# EAGLE design CANMP3_rev6_ar (EAGLE 8.5.0)
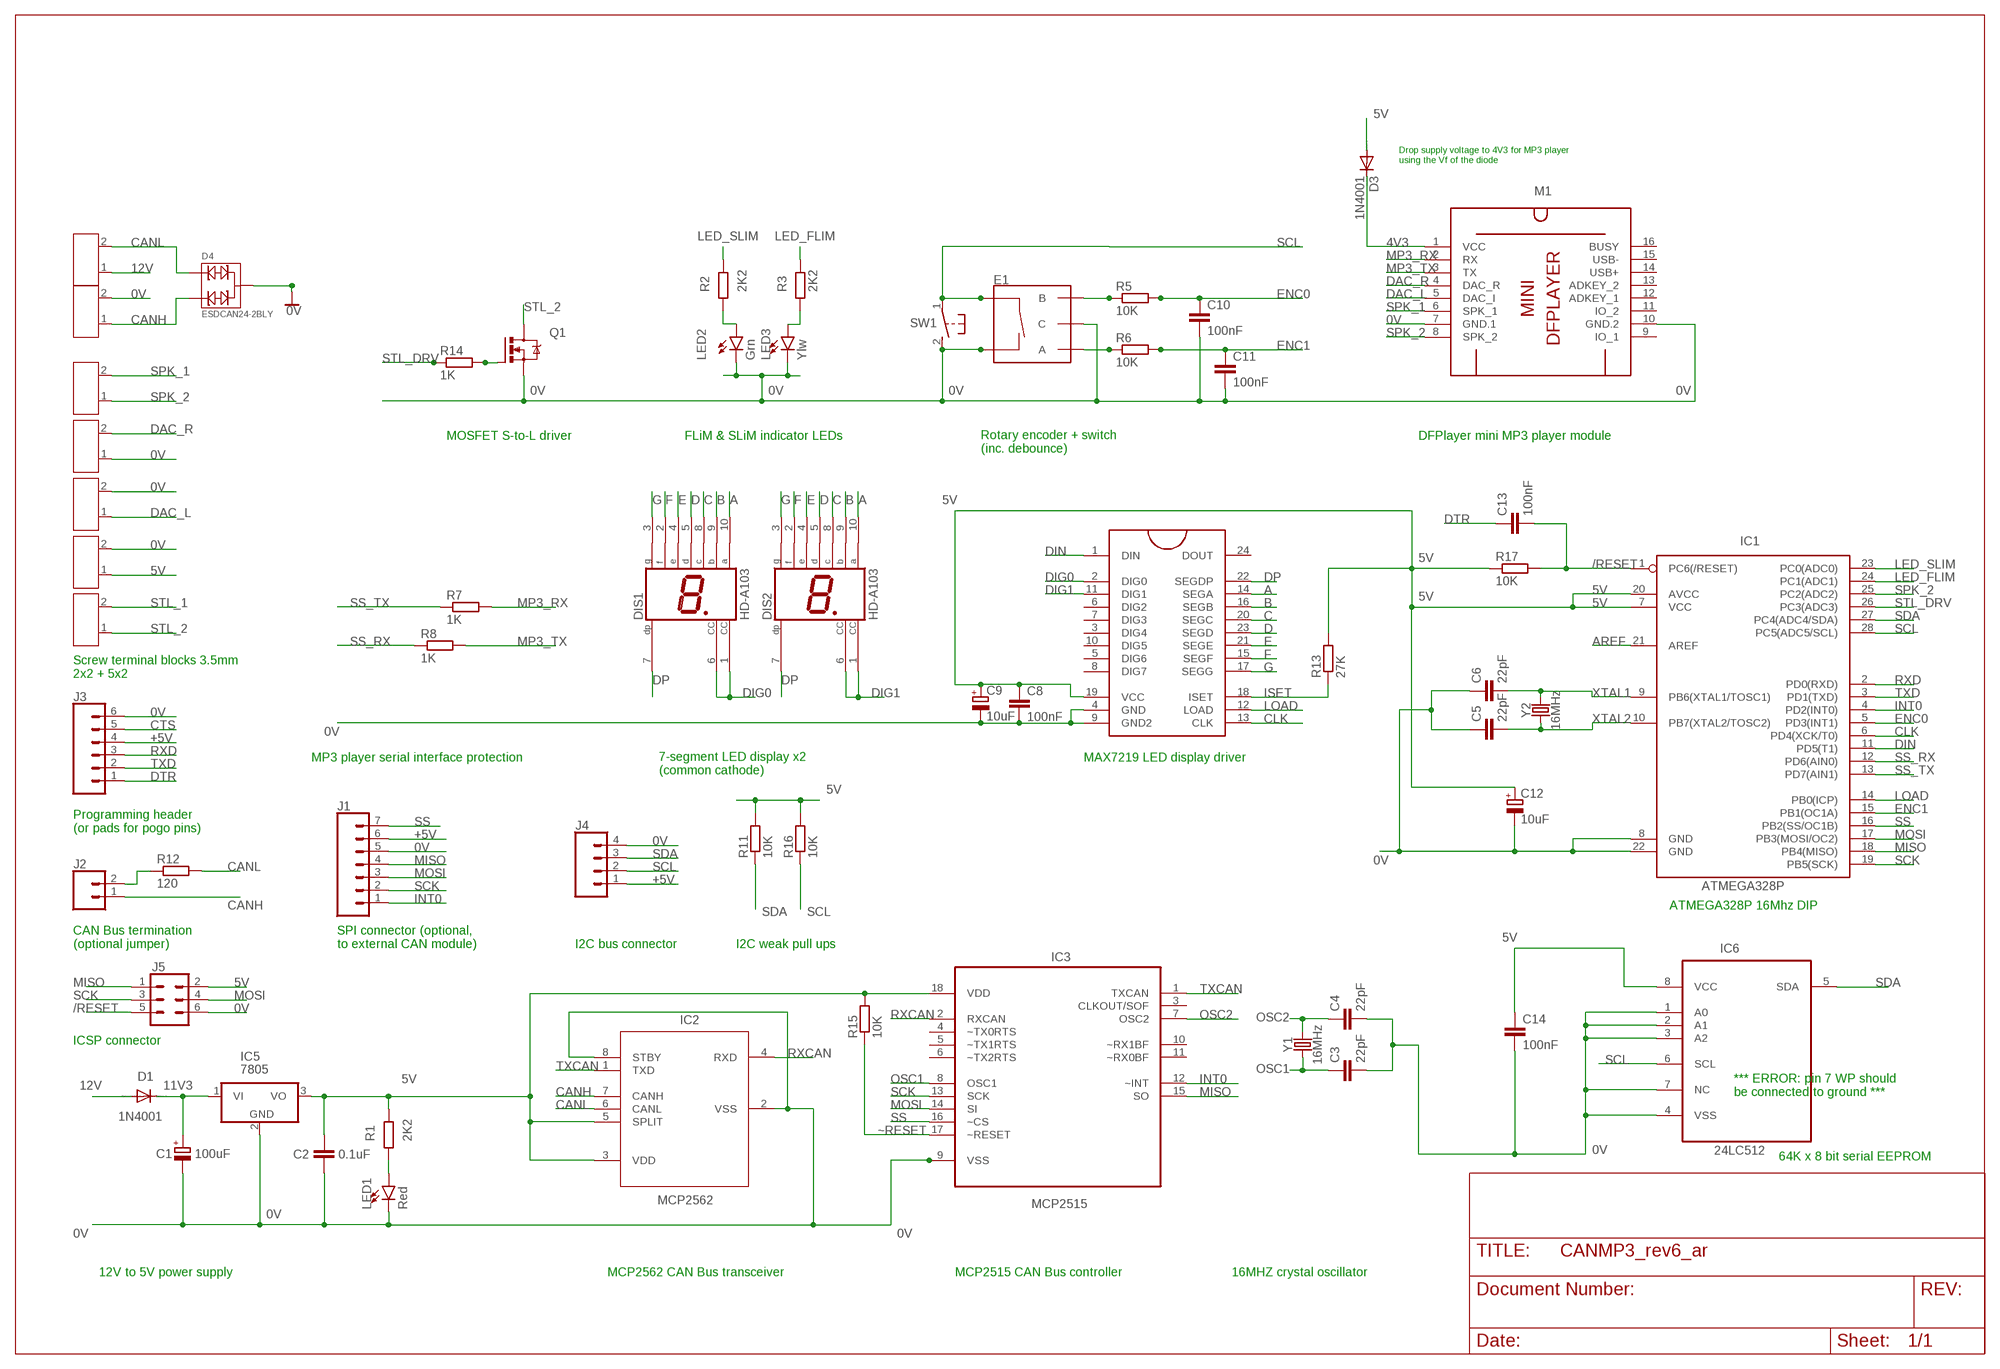
[diagram p0: schematic, sheet 1]

## Parts
C1  100uF  CPOL-EUE2.5-6  [E2,5-6]
C2  0.1uF  C-EU025-025X050  [C025-025X050]
C3  22pF  C-EU025-024X044  [C025-024X044]
C4  22pF  C-EU025-024X044  [C025-024X044]
C5  22pF  C-EU025-024X044  [C025-024X044]
C6  22pF  C-EU025-024X044  [C025-024X044]
C8  100nF  C-EU025-024X044  [C025-024X044]
C9  10uF  CPOL-EUE2.5-5  [E2,5-5]
C10  100nF  C-EU025-024X044  [C025-024X044]
C11  100nF  C-EU025-024X044  [C025-024X044]
C12  10uF  CPOL-EUE2,5-6E  [E2,5-6E]
C13  100nF  C-EU025-024X044  [C025-024X044]
C14  100nF  C-EU025-024X044  [C025-024X044]
D1  1N4001  DIODE-DO41-10  [DO41-10]
D3  1N4001  DIODE-DO41-10  [DO41-10]
D4  ESDCAN24-2BLY  SMD-DIODE-TVS-5V-225MW(SOT-23)  [SOT-23]
DIS1  HD-A103  [HDSP-A]
DIS2  HD-A103  [HDSP-A]
E1  ENCODER-SWITCH  [ROTARY_ENC_PLAIN]
IC1  ATMEGA328P  ATMEGA328P_PDIP  [DIP28]
IC2  MCP2562  MCP2562-E/P  [PDIP8_300MC]
IC3  MCP2515  MCP2515-I/P  [DIP254P762X432-18]
IC4  MAX7219  MAX7219DIP  [DIL24]
IC5  7805  7805TV  [TO220V]
IC6  24LC512  24C65/P  [DIP254P762X432-8]
J1  CONN_07  [1X07]
J2  CONN_02  [1X02]
J3  CONN_06SILK_FEMALE_PTH  [1X06]
J4  CONN_04  [1X04]
J5  FEMALE 2x3  CONN_03X2FEMALE  [2X3]
LED1  Red  LED3MM  [LED_3MM]
LED2  Grn  LED3MM  [LED_3MM]
LED3  Ylw  LED3MM  [LED_3MM]
M1  DFPLAYER-MINI-MODULE  [DFPLAYER-MINI-MODULE]
Q1  IRF540  [TO220BV]
R1  2K2  R-EU_0207/10  [0207/10]
R2  2K2  R-EU_0207/10  [0207/10]
R3  2K2  R-EU_0207/10  [0207/10]
R5  10K  R-EU_0207/10  [0207/10]
R6  10K  R-EU_0207/10  [0207/10]
R7  1K  R-EU_0207/10  [0207/10]
R8  1K  R-EU_0207/10  [0207/10]
R11  10K  R-EU_0207/10  [0207/10]
R12  120  R-EU_0207/10  [0207/10]
R13  27K  R-EU_0207/10  [0207/10]
R14  1K  R-EU_0207/10  [0207/10]
R15  10K  R-EU_0207/10  [0207/10]
R16  10K  R-EU_0207/10  [0207/10]
R17  10K  R-EU_0207/10  [0207/10]
SW1  DTS-3  [DTS-3]
TB1  SCREW-TERMINAL-GREEN(2P-3.5)  [H2-3.5-7.0X7.0MM]
TB2  SCREW-TERMINAL-GREEN(2P-3.5)  [H2-3.5-7.0X7.0MM]
TB3  SCREW-TERMINAL-GREEN(2P-3.5)  [H2-3.5-7.0X7.0MM]
TB4  SCREW-TERMINAL-GREEN(2P-3.5)  [H2-3.5-7.0X7.0MM]
TB5  SCREW-TERMINAL-GREEN(2P-3.5)  [H2-3.5-7.0X7.0MM]
TB6  SCREW-TERMINAL-GREEN(2P-3.5)  [H2-3.5-7.0X7.0MM]
TB7  SCREW-TERMINAL-GREEN(2P-3.5)  [H2-3.5-7.0X7.0MM]
Y1  16MHz  CRYSTAL-16MHZPTH-HC49US  [HC49US]
Y2  16MHz  CRYSTAL-16MHZPTH-HC49US  [HC49US]

## Nets
0V [power]: C1.- C2.2 C3.2 C4.2 C5.1 C6.1 C8.2 C9.- C10.2 C11.2 C12.- C14.2 D4.3 E1.C E1.SW- IC1.8(GND) IC1.22(GND) IC2.2(VSS) IC2.8(STBY) IC3.9(VSS) IC4.4(GND) IC4.9(GND2) IC5.2(GND) IC6.1(A0) IC6.2(A1) IC6.3(A2) IC6.4(VSS) IC6.7(NC) J1.5 J3.6 J4.4 J5.6 LED1.K(C) LED2.K(C) LED3.K(C) M1.7(GND.1) M1.10(GND.2) Q1.S SW1.2 TB2.2 TB4.2 TB5.2 TB6.1
4V3: D3.C M1.1(VCC)
5V [power]: C2.1 C8.1 C9.+ C12.+ C14.1 D3.A IC1.7(VCC) IC1.20(AVCC) IC2.3(VDD) IC2.5(SPLIT) IC3.18(VDD) IC4.19(VCC) IC5.3(VO) IC6.8(VCC) J5.2 R1.2 R11.2 R13.2 R15.2 R16.2 R17.1 TB5.1
11V3 [power]: C1.+ D1.C IC5.1(VI)
12V [power]: D1.A TB1.1
+5V: J1.6 J3.4 J4.1
/RESET: C13.2 IC1.1(PC6(/RESET)) J5.5 R17.2
A: DIS1.10(A) DIS2.10(A) IC4.14(SEGA)
AREF: IC1.21(AREF)
B: DIS1.9(B) DIS2.9(B) IC4.16(SEGB)
C: DIS1.8(C) DIS2.8(C) IC4.20(SEGC)
CANH: D4.2 IC2.7(CANH) J2.1 TB2.1
CANL: D4.1 IC2.6(CANL) R12.2 TB1.2
CLK: IC1.6(PD4(XCK/T0)) IC4.13(CLK)
CTS: J3.5
D: DIS1.5(D) DIS2.5(D) IC4.23(SEGD)
DAC_L: M1.5(DAC_I) TB4.1
DAC_R: M1.4(DAC_R) TB6.2
DIG0: DIS1.1(CC) DIS1.6(CC) IC4.2(DIG0)
DIG1: DIS2.1(CC) DIS2.6(CC) IC4.11(DIG1)
DIN: IC1.11(PD5(T1)) IC4.1(DIN)
DP: DIS1.7(DP) DIS2.7(DP) IC4.22(SEGDP)
DTR: C13.1 J3.1
E: DIS1.4(E) DIS2.4(E) IC4.21(SEGE)
ENC0: C10.1 IC1.5(PD3(INT1)) R5.2
ENC1: C11.1 IC1.15(PB1(OC1A)) R6.2
F: DIS1.2(F) DIS2.2(F) IC4.15(SEGF)
G: DIS1.3(G) DIS2.3(G) IC4.17(SEGG)
INT0: IC1.4(PD2(INT0)) IC3.12(~INT) J1.1
ISET: IC4.18(ISET) R13.1
LED_FLIM: IC1.24(PC1(ADC1)) R3.2
LED_SLIM: IC1.23(PC0(ADC0)) R2.2
LOAD: IC1.14(PB0(ICP)) IC4.12(LOAD)
MISO: IC1.18(PB4(MISO)) IC3.15(SO) J1.4 J5.1
MOSI: IC1.17(PB3(MOSI/OC2)) IC3.14(SI) J1.3 J5.4
MP3_RX: M1.2(RX) R7.2
MP3_TX: M1.3(TX) R8.2
N$3: LED1.A R1.1
N$5: J2.2 R12.1
N$6: E1.B R5.1
N$7: E1.A R6.1
N$10: LED2.A R2.1
N$11: LED3.A R3.1
N$15: Q1.G R14.2
OSC1: C3.1 IC3.8(OSC1) Y1.1
OSC2: C4.1 IC3.7(OSC2) Y1.2
RXCAN: IC2.4(RXD) IC3.2(RXCAN)
RXD: IC1.2(PD0(RXD)) J3.3
SCK: IC1.19(PB5(SCK)) IC3.13(SCK) J1.2 J5.3
SCL: E1.SW+ IC1.28(PC5(ADC5/SCL)) IC6.6(SCL) J4.2 R16.1 SW1.1
SDA: IC1.27(PC4(ADC4/SDA)) IC6.5(SDA) J4.3 R11.1
SPK_1: M1.6(SPK_1) TB3.2
SPK_2: IC1.25(PC2(ADC2)) M1.8(SPK_2) TB3.1
SS: IC1.16(PB2(SS/OC1B)) IC3.16(~CS) J1.7
SS_RX: IC1.12(PD6(AIN0)) R8.1
SS_TX: IC1.13(PD7(AIN1)) R7.1
STL_1: TB7.2
STL_2: Q1.D TB7.1
STL_DRV: IC1.26(PC3(ADC3)) R14.1
TXCAN: IC2.1(TXD) IC3.1(TXCAN)
TXD: IC1.3(PD1(TXD)) J3.2
XTAL1: C6.2 IC1.9(PB6(XTAL1/TOSC1)) Y2.2
XTAL2: C5.2 IC1.10(PB7(XTAL2/TOSC2)) Y2.1
~RESET: IC3.17(~RESET) R15.1
Unconnected: IC3.3(CLKOUT/SOF) IC3.4(~TX0RTS) IC3.5(~TX1RTS) IC3.6(~TX2RTS) IC3.10(~RX1BF) IC3.11(~RX0BF) IC4.3(DIG4) IC4.5(DIG6) IC4.6(DIG2) IC4.7(DIG3) IC4.8(DIG7) IC4.10(DIG5) IC4.24(DOUT) M1.9(IO_1) M1.11(IO_2) M1.12(ADKEY_1) M1.13(ADKEY_2) M1.14(USB+) M1.15(USB-) M1.16(BUSY)

## Notes on the sheet
- Drop supply voltage to 4V3 for MP3 player
  using the Vf of the diode
- MOSFET S-to-L driver | FLiM & SLiM indicator LEDs | DFPlayer mini MP3 player module
- Rotary encoder + switch
  (inc. debounce)
- Screw terminal blocks 3.5mm
  2x2 + 5x2
- MP3 player serial interface protection | MAX7219 LED display driver
- 7-segment LED display x2
  (common cathode)
- Programming header
  (or pads for pogo pins)
- ATMEGA328P 16Mhz DIP
- CAN Bus termination
  (optional jumper)
- SPI connector (optional,
  to external CAN module)
- I2C bus connector | I2C weak pull ups
- ICSP connector
- *** ERROR: pin 7 WP should 
  be connected to ground ***
- 64K x 8 bit serial EEPROM
- 12V to 5V power supply | MCP2562 CAN Bus transceiver | MCP2515 CAN Bus controller | 16MHZ crystal oscillator

## Library data of the parts
C1 C9 C12 = resistor:CPOL-EU: POLARIZED CAPACITOR, European symbol
C2-C6 C8 C10 C11 C13 C14 = resistor:C-EU: CAPACITOR, European symbol
D1 D3 = diode:DIODE-: DIODE
D4 = Seeed-Diode:SMD-DIODE-TVS-5V-225MW(SOT-23): 304050003; MPN: CESD5V0AP; VALUE: 5V-225MW
DIS1 DIS2 = display-hp:HD-A103: LED DISPLAY 1-character 7 segment, decimal point right; OC_FARNELL: unknown; OC_NEWARK: unknown
E1 = SparkFun-Switches:ENCODER-SWITCH: Rotary Encoder w/ Select Switch Encoders rotate similarly to potentiometers, but they’re different from potentiometers in that an encoder has full rotation without limits. They output gray code so that you can tell how much and in which direction the encoder has been turned. This encoder includes a push-down select switch built into the shaft. SparkFun Products Rotary Encoder <https://www.sparkfun.com/products/9117> (COM-09117); SF_SKU: COM-09117
IC1 = SparkFun-IC-Microcontroller:ATMEGA328P_PDIP: Atmel 328P Through hole ATMEGA328P uC used in the Arduino 32kb flash, 1k EEPROM, 2k SRAM Datasheet <http://www.sparkfun.com/datasheets/Components/SMD/ATMega328.pdf> SparkFun Products Storefront component: AVR 28 Pin 20MHz 32K 6A/D - ATMega328P <https://www.sparkfun.com/products/9061> (COM-09061) SparkFun Simon Says - Through-Hole Soldering Kit <https://www.sparkfun.com/products/10547> (KIT-10547) SparkFun Learn to Solder - Simon Says <https://www.sparkfun.com/products/13708> (KIT-13708) SparkFun BigTime Watch Kit <https://www.sparkfun.com/products/11734> (KIT-11734) SparkFun ClockIt <https://www.sparkfun.com/products/10930> (KIT-10930) SparkFun Serial Enabled LCD Kit <https://www.sparkfun.com/products/10097> (LCD-10097) SparkFun Simon Tilts - Through Hole Soldering Kit <https://www.sparkfun.com/products/12634> (KIT-12634) SparkFun Frequency Counter Kit <https://www.sparkfun.com/products/10140> (KIT-10140) FabFM Radio Kit <https://www.sparkfun.com/products/11043> (KIT-11043) SparkFun Binary Blaster Kit <https://www.sparkfun.com/products/12037> (KIT-12037) SparkFun Metro-Gnome <https://www.sparkfun.com/products/9236> (KIT-09236) ATmega328 with Arduino Optiboot (Uno) <https://www.sparkfun.com/products/10524> (DEV-10524); PROD_ID: IC-09136; VALUE: 328P
IC2 = untitled:MCP2562-E/P; MANUFACTURER_PART_NUMBER: MCP2562EP; VENDOR: MICROCHIP
IC3 = Microchip_By_element14_Batch_1:MCP2515-I/P: Stand-Alone CAN Controller; DESCRIPTION: CAN CONTRL; MPN: MCP2515-I/P; OC_FARNELL: 1439391; OC_NEWARK: 61K2945; PACKAGE: PDIP-18; SUPPLIER: MICROCHIP
IC4 = SparkFun-Retired:MAX7219: 8-digit, 8-segment LED display driver, serial input
IC5 = linear:78*: Positive VOLTAGE REGULATOR Source: http://cache.national.com/ds/LM/LM78L05.pdf http://www.fairchildsemi.com/ds/LM/LM7805.pdf
IC6 = Microchip_By_element14_Batch_1:24C65/P: 64K I2C Smart Serial EEPROM; MPN: 24C65/P; OC_FARNELL: 9757821; OC_NEWARK: 89C9798; PACKAGE: DIP-8; SUPPLIER: MICROCHIP
J1 = SparkFun-Connectors:CONN_07: Multi connection point. Often used as Generic Header-pin footprint for 0.1 inch spaced/style header connections On any of the 0.1 inch spaced packages, you can populate with these: Break Away Headers - Straight <https://www.sparkfun.com/products/116> (PRT-00116) Break Away Male Headers - Right Angle <https://www.sparkfun.com/products/553> (PRT-00553) Female Headers <https://www.sparkfun.com/products/115> (PRT-00115) Break Away Headers - Machine Pin <https://www.sparkfun.com/products/117> (PRT-00117) Break Away Female Headers - Swiss Machine Pin <https://www.sparkfun.com/products/743> (PRT-00743) For SCREWTERMINALS and SPRING TERMINALS visit here: Screw Terimnals on SparkFun.com <https://www.sparkfun.com/search/results?term=Screw+Terminals> (5mm/3.5mm/2.54mm spacing) This device is also useful as a general connection point to wire up your design to another part of your project. Our various solder wires solder well into these plated through hole pads. Hook-Up Wire - Assortment (Stranded, 22 AWG) <https://www.sparkfun.com/products/11375> (PRT-11375) Hook-Up Wire - Assortment (Solid Core, 22 AWG) <https://www.sparkfun.com/products/11367> (PRT-11367) View the entire wire category on our website here <https://www.sparkfun.com/categories/141> Special notes: Molex polarized connector foot print use with SKU : PRT-08231 with associated crimp pins and housings. 1MM SMD Version SKU: PRT-10208 NOTES ON THE VARIANTS LOCK and LOCK_LONGPADS... This footprint was designed to help hold the alignment of a through-hole component (i.e. 6-pin header) while soldering it into place. You may notice that each hole has been shifted either up or down by 0.005 of an inch from it's more standard position (which is a perfectly straight line). This slight alteration caused the pins (the squares in the middle) to touch the edges of the holes. Because they are alternating, it causes a "brace" to hold the component in place. 0.005 has proven to be the perfect amount of "off-center" position when using our standard breakaway headers. Although looks a little odd when you look at the bare footprint, once you have a header in there, the alteration is very hard to notice. Also,if you push a header all the way into place, it is covered up entirely on the bottom side.
J2 = SparkFun-Connectors:CONN_02: Multi connection point. Often used as Generic Header-pin footprint for 0.1 inch spaced/style header connections On any of the 0.1 inch spaced packages, you can populate with these: Break Away Headers - Straight <https://www.sparkfun.com/products/116> (PRT-00116) Break Away Male Headers - Right Angle <https://www.sparkfun.com/products/553> (PRT-00553) Female Headers <https://www.sparkfun.com/products/115> (PRT-00115) Break Away Headers - Machine Pin <https://www.sparkfun.com/products/117> (PRT-00117) Break Away Female Headers - Swiss Machine Pin <https://www.sparkfun.com/products/743> (PRT-00743) For SCREWTERMINALS and SPRING TERMINALS visit here: Screw Terimnals on SparkFun.com <https://www.sparkfun.com/search/results?term=Screw+Terminals> (5mm/3.5mm/2.54mm spacing) This device is also useful as a general connection point to wire up your design to another part of your project. Our various solder wires solder well into these plated through hole pads. Hook-Up Wire - Assortment (Stranded, 22 AWG) <https://www.sparkfun.com/products/11375> (PRT-11375) Hook-Up Wire - Assortment (Solid Core, 22 AWG) <https://www.sparkfun.com/products/11367> (PRT-11367) View the entire wire category on our website here <https://www.sparkfun.com/categories/141> Special notes: Molex polarized connector foot print use with: PRT-08233 with associated crimp pins and housings. 2.54_SCREWTERM for use with PRT-10571. 3.5mm Screw Terminal footprints for PRT-08084 5mm Screw Terminal footprints for use with PRT-08432
J3 = SparkFun-Connectors:CONN_06: Multi connection point. Often used as Generic Header-pin footprint for 0.1 inch spaced/style header connections On any of the 0.1 inch spaced packages, you can populate with these: Break Away Headers - Straight <https://www.sparkfun.com/products/116> (PRT-00116) Break Away Male Headers - Right Angle <https://www.sparkfun.com/products/553> (PRT-00553) Female Headers <https://www.sparkfun.com/products/115> (PRT-00115) Break Away Headers - Machine Pin <https://www.sparkfun.com/products/117> (PRT-00117) Break Away Female Headers - Swiss Machine Pin <https://www.sparkfun.com/products/743> (PRT-00743) Arduino Stackable Header - 6 Pin <https://www.sparkfun.com/products/9280> (PRT-09280) For SCREWTERMINALS and SPRING TERMINALS visit here: Screw Terimnals on SparkFun.com <https://www.sparkfun.com/search/results?term=Screw+Terminals> (5mm/3.5mm/2.54mm spacing) This device is also useful as a general connection point to wire up your design to another part of your project. Our various solder wires solder well into these plated through hole pads. Hook-Up Wire - Assortment (Stranded, 22 AWG) <https://www.sparkfun.com/products/11375> (PRT-11375) Hook-Up Wire - Assortment (Solid Core, 22 AWG) <https://www.sparkfun.com/products/11367> (PRT-11367) View the entire wire category on our website here <https://www.sparkfun.com/categories/141>; PROD_ID: CONN-08437
J4 = SparkFun-Connectors:CONN_04: Multi connection point. Often used as Generic Header-pin footprint for 0.1 inch spaced/style header connections On any of the 0.1 inch spaced packages, you can populate with these: Break Away Headers - Straight <https://www.sparkfun.com/products/116> (PRT-00116) Break Away Male Headers - Right Angle <https://www.sparkfun.com/products/553> (PRT-00553) Female Headers <https://www.sparkfun.com/products/115> (PRT-00115) Break Away Headers - Machine Pin <https://www.sparkfun.com/products/117> (PRT-00117) Break Away Female Headers - Swiss Machine Pin <https://www.sparkfun.com/products/743> (PRT-00743) For SCREWTERMINALS and SPRING TERMINALS visit here: Screw Terimnals on SparkFun.com <https://www.sparkfun.com/search/results?term=Screw+Terminals> (5mm/3.5mm/2.54mm spacing) This device is also useful as a general connection point to wire up your design to another part of your project. Our various solder wires solder well into these plated through hole pads. Hook-Up Wire - Assortment (Stranded, 22 AWG) <https://www.sparkfun.com/products/11375> (PRT-11375) Hook-Up Wire - Assortment (Solid Core, 22 AWG) <https://www.sparkfun.com/products/11367> (PRT-11367) View the entire wire category on our website here <https://www.sparkfun.com/categories/141> Special notes: Molex polarized connector foot print use with SKU : PRT-08231 with associated crimp pins and housings. 1MM SMD Version SKU: PRT-10208; PROD_ID: CONN-09696
J5 = SparkFun-Connectors:CONN_03X2: Multi connection point. Often used as Generic Header-pin footprint for 0.1 inch spaced/style header connections You can populate with any combo of single row headers, but if you'd like an exact match, check these: Header - 2x3 (Male, 0.1") <https://www.sparkfun.com/products/12807> (PRT-12807) Header - 2x3 (Female, 0.1") <https://www.sparkfun.com/products/13010> (PRT-13010) 2x3 Pin Shrouded Header <https://www.sparkfun.com/products/10877> (PRT-10877) On any of the 0.1 inch spaced packages, you can populate with these: Break Away Headers - Straight <https://www.sparkfun.com/products/116> (PRT-00116) Break Away Male Headers - Right Angle <https://www.sparkfun.com/products/553> (PRT-00553) Female Headers <https://www.sparkfun.com/products/115> (PRT-00115) Break Away Headers - Machine Pin <https://www.sparkfun.com/products/117> (PRT-00117) Break Away Female Headers - Swiss Machine Pin <https://www.sparkfun.com/products/743> (PRT-00743) Special note: the shrouded connector mates well with our 3x2 ribbon cables: Ribbon Crimp Connector - 6-pin (2x3, Female) <https://www.sparkfun.com/products/10651> (PRT-10651) Ribbon Cable - 6 wire (15ft) <https://www.sparkfun.com/products/10646> (PRT-10646); PROD_ID: CONN-11566
LED1-LED3 = SparkFun-LED:LED: LED (Generic) Standard schematic elements and footprints for 5mm, 3mm, 1206, and 0603 sized LEDs. Generic LEDs with no color specified.; PROD_ID: DIO-08794
M1 = diy-modules:DFPLAYER-MINI-MODULE: DFPlayer Mini - MP3 player module based on YX5200 chip More details available here: https://www.dfrobot.com/wiki/index.php/DFPlayer_Mini_SKU:DFR0299 Click here to find device on ebay.com <http://www.ebay.com/sch/dfplayer+mini>
Q1 = transistor-power:IRF540: HEXFET Power MOSFET
R1-R3 R5-R8 R11-R17 = resistor:R-EU_: RESISTOR, European symbol
SW1 = switch_tact:DTS-3
TB1-TB7 = Seeed-Connector:SCREW-TERMINAL-GREEN(2P-3.5): 320110028; VALUE: GREEN-2P-3.5
Y1 Y2 = SparkFun-Clocks:CRYSTAL-16MHZ: 16MHz Crystal Digikey Example <http://www.digikey.com/product-search/en?keywords=535-9122-1-ND> Frequency: 16MHz Frequency Stability: ±50ppm Frequency Tolerance: ±20ppm Load Capacitance: 18pF SparkFun Products: Pro Micro -5V/16MHz <https://www.sparkfun.com/products/12640> SparkFun Serial Enabled LCD Kit <https://www.sparkfun.com/products/10097>; PROD_ID: XTAL-08181; SF_ID: COM-00536

## Net classes
0 default: width 0.152 mm, clearance 0.152 mm
1 power: width 0.305 mm, clearance 0.152 mm

## Board
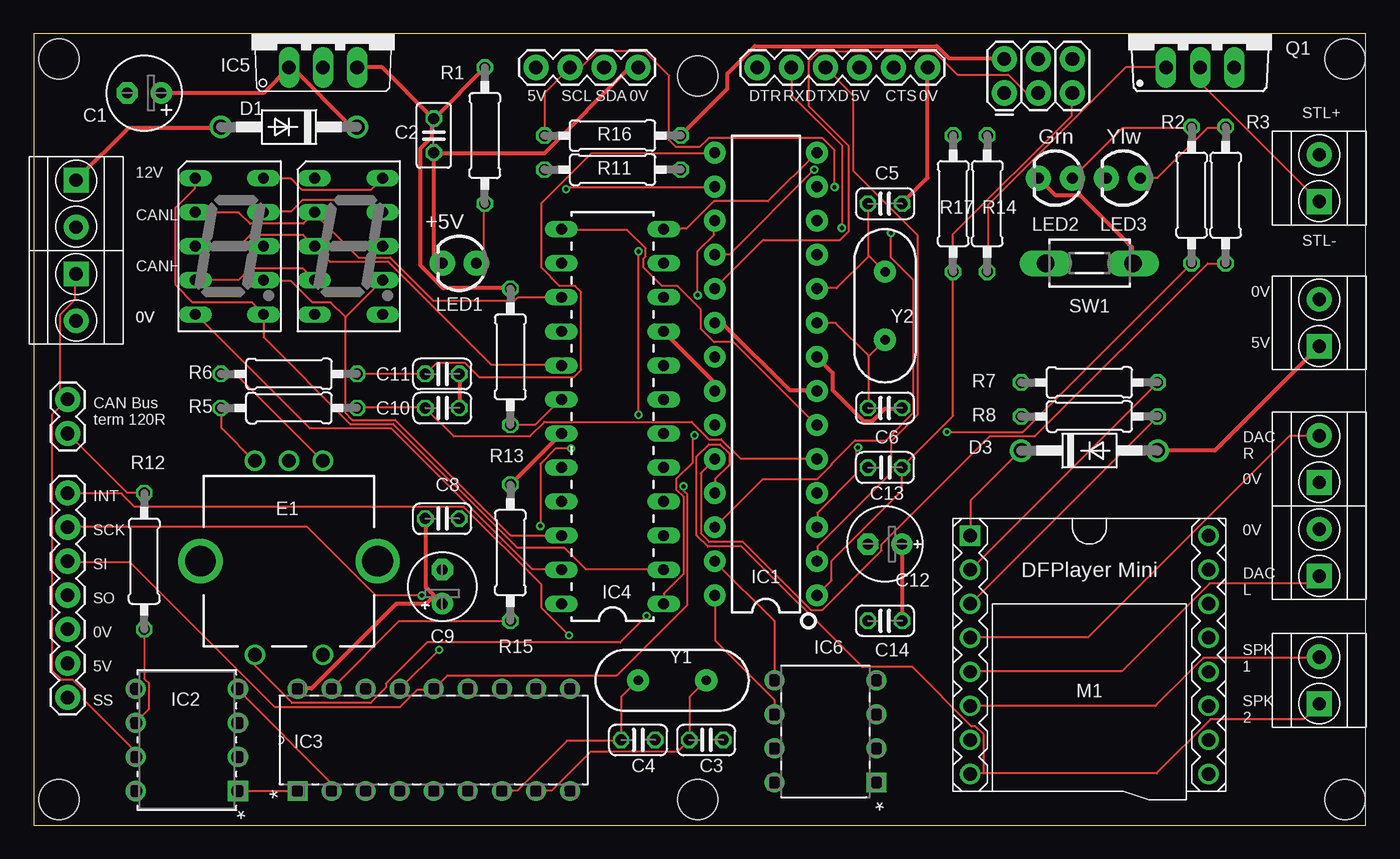
[diagram p1: board, top side]
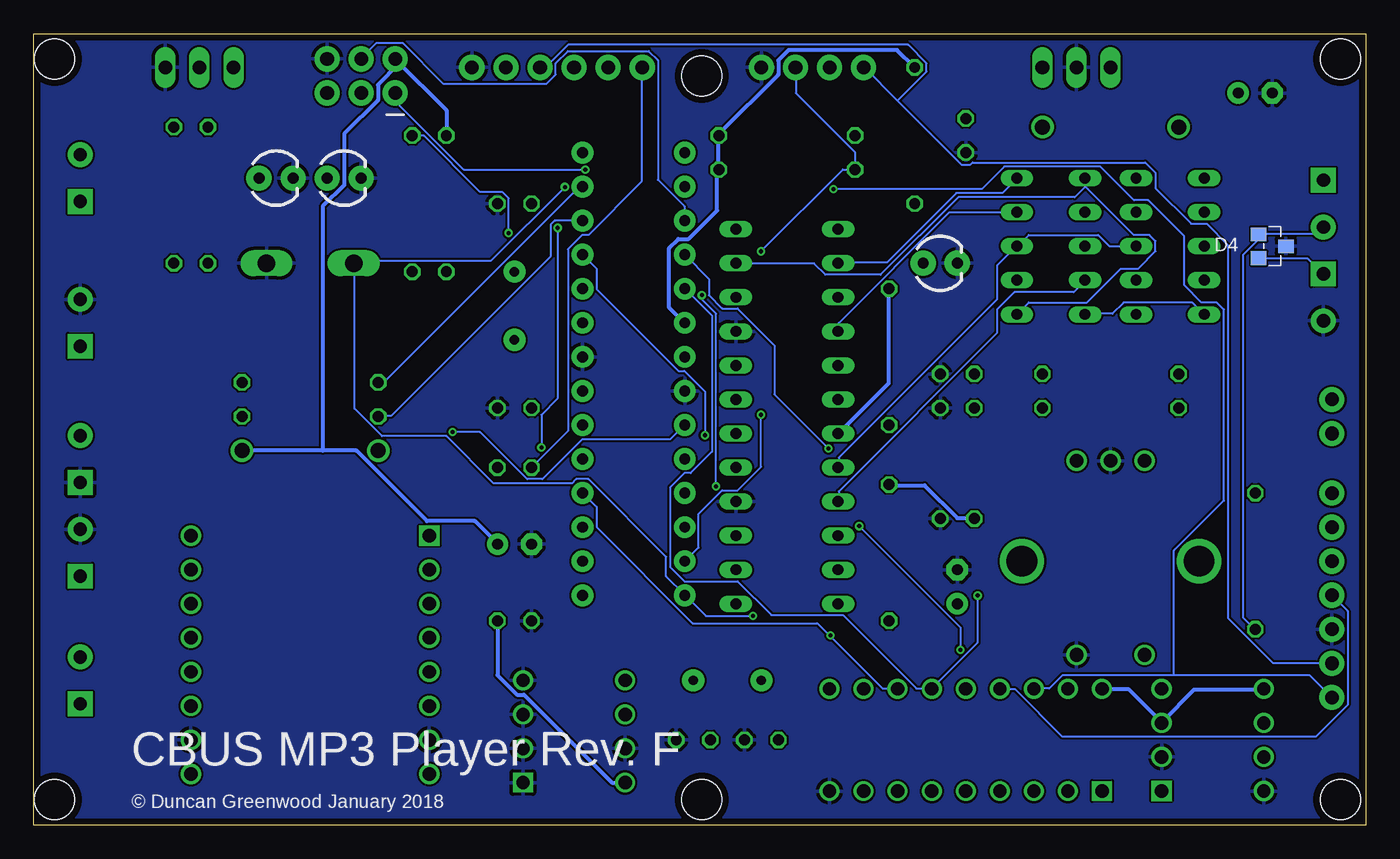
[diagram p2: board, bottom side, seen from below]

Size 99.36 x 59.05 mm. Coordinates in mm from the lower left corner, seen from the top.
Outline: 0,0 99.36,0 99.36,59.05 0,59.05 0,0
Copper layers (1*16): Top 0.035mm / dielectric 1.6mm / Bottom 0.035mm
Design rules "Elecrow_2-layer_PCB_eagle_rule": minimum track width 6mil, minimum drill 12mil, track to track 6mil, track to pad 6mil, pad to pad 6mil, via to via 8mil, smd to smd 0mil, copper to edge 20mil, drill to drill 10mil, minimum pad ring 6mil, minimum via ring 6mil, stop-mask expansion 0mil, vias tented up to drill 100mil, thermal gap 10mil
Holes 3 mm at 1.91,57.15 1.91,1.91 97.79,57.15 97.79,1.91 49.53,55.88 49.53,1.91

### Footprints (pad centres in the part's own frame; a part is rotated, then mirrored left to right if it is on the bottom)
E2,5-6 = drill 0.813 pad 1.6: + -1.27,0 | drill 0.813 pad 1.6 octagon: - 1.27,0
C025-025X050 = drill 0.813 octagon: 1 -1.27,0; 2 1.27,0
C025-024X044 = drill 0.813 octagon: 1 -1.27,0; 2 1.27,0
E2,5-5 = drill 0.813 pad 1.6: + -1.27,0 | drill 0.813 pad 1.6 octagon: - 1.27,0
E2,5-6E = drill 0.813 pad 1.575: + -1.27,0 | drill 0.813 pad 1.575 octagon: - 1.27,0
DO41-10 = drill 1.118: A 5.08,0; C -5.08,0
SOT-23 = smd 1.016 x 1.143: 1 -0.889,-1.016; 2 0.889,-1.016; 3 0,1.016
HDSP-A = drill 0.813 long: 1 -2.54,5.08; 2 -2.54,2.54; 3 -2.54,0; 4 -2.54,-2.54; 5 -2.54,-5.08; 6 2.54,-5.08; 7 2.54,-2.54; 8 2.54,0; 9 2.54,2.54; 10 2.54,5.08
ROTARY_ENC_PLAIN = drill 1.016: A 7.493,-2.54; B 7.493,2.54; C 7.493,0; SW+ -6.985,2.54; SW- -6.985,-2.54 | drill 2.286: P$3 0,6.604; P$4 0,-6.604
DIP28 = drill 0.813 pad 1.626: 1 -16.51,-3.81; 2 -13.97,-3.81; 3 -11.43,-3.81; 4 -8.89,-3.81; 5 -6.35,-3.81; 6 -3.81,-3.81; 7 -1.27,-3.81; 8 1.27,-3.81; 9 3.81,-3.81; 10 6.35,-3.81; 11 8.89,-3.81; 12 11.43,-3.81; 13 13.97,-3.81; 14 16.51,-3.81; 15 16.51,3.81; 16 13.97,3.81; 17 11.43,3.81; 18 8.89,3.81; 19 6.35,3.81; 20 3.81,3.81; 21 1.27,3.81; 22 -1.27,3.81; 23 -3.81,3.81; 24 -6.35,3.81; 25 -8.89,3.81; 26 -11.43,3.81; 27 -13.97,3.81; 28 -16.51,3.81
PDIP8_300MC = drill 0.991 pad 1.499 square: 1 -7.62,7.62 | drill 0.991 pad 1.499: 2 -7.62,5.08; 3 -7.62,2.54; 4 -7.62,0; 5 0,0; 6 0,2.54; 7 0,5.08; 8 0,7.62
DIP254P762X432-18 = drill 0.991 square: 1 -7.62,20.32 | drill 0.991: 2 -7.62,17.78; 3 -7.62,15.24; 4 -7.62,12.7; 5 -7.62,10.16; 6 -7.62,7.62; 7 -7.62,5.08; 8 -7.62,2.54; 9 -7.62,0; 10 0,0; 11 0,2.54; 12 0,5.08; 13 0,7.62; 14 0,10.16; 15 0,12.7; 16 0,15.24; 17 0,17.78; 18 0,20.32
DIL24 = drill 0.813 long: 1 -13.97,-3.81; 2 -11.43,-3.81; 3 -8.89,-3.81; 4 -6.35,-3.81; 5 -3.81,-3.81; 6 -1.27,-3.81; 7 1.27,-3.81; 8 3.81,-3.81; 9 6.35,-3.81; 10 8.89,-3.81; 11 11.43,-3.81; 12 13.97,-3.81; 13 13.97,3.81; 14 11.43,3.81; 15 8.89,3.81; 16 6.35,3.81; 17 3.81,3.81; 18 1.27,3.81; 19 -1.27,3.81; 20 -3.81,3.81; 21 -6.35,3.81; 22 -8.89,3.81; 23 -11.43,3.81; 24 -13.97,3.81
TO220V = drill 1.016 long: 1 -2.54,-2.54; 2 0,-2.54; 3 2.54,-2.54
DIP254P762X432-8 = drill 0.991 square: 1 -7.62,7.62 | drill 0.991: 2 -7.62,5.08; 3 -7.62,2.54; 4 -7.62,0; 5 0,0; 6 0,2.54; 7 0,5.08; 8 0,7.62
1X07 = drill 1.016 pad 1.88: 1 0,0; 2 2.54,0; 3 5.08,0; 4 7.62,0; 5 10.16,0; 6 12.7,0; 7 15.24,0
1X02 = drill 1.016 pad 1.88: 1 0,0; 2 2.54,0
1X06 = drill 1.016 pad 1.88: 1 0,0; 2 2.54,0; 3 5.08,0; 4 7.62,0; 5 10.16,0; 6 12.7,0
1X04 = drill 1.016 pad 1.88: 1 0,0; 2 2.54,0; 3 5.08,0; 4 7.62,0
2X3 = drill 1.016 pad 1.88: 1 0,0; 2 0,2.54; 3 2.54,0; 4 2.54,2.54; 5 5.08,0; 6 5.08,2.54
LED_3MM = drill 0.813 pad 1.88: A -1.27,0; K 1.27,0
DFPLAYER-MINI-MODULE = drill 1 square: 1 -8.89,-8.89 | drill 1: 2 -6.35,-8.89; 3 -3.81,-8.89; 4 -1.27,-8.89; 5 1.27,-8.89; 6 3.81,-8.89; 7 6.35,-8.89; 8 8.89,-8.89; 9 8.89,8.89; 10 6.35,8.89; 11 3.81,8.89; 12 1.27,8.89; 13 -1.27,8.89; 14 -3.81,8.89; 15 -6.35,8.89; 16 -8.89,8.89
TO220BV = drill 1.016 long: D 0,-2.54; G -2.54,-2.54; S 2.54,-2.54
0207/10 = drill 0.813 octagon: 1 -5.08,0; 2 5.08,0
DTS-3 = drill 1.3 long: 1 -3.25,0; 2 3.25,0
H2-3.5-7.0X7.0MM = drill 1 pad 1.85 square: 1 -1.75,0 | drill 1 pad 1.85: 2 1.75,0
HC49US = drill 0.7 pad 1.651: 1 -2.54,0; 2 2.54,0

### Placement (x,y rotation side)
C1  8.26,54.61 180 top
C2  29.84,51.44 270 top
C3  50.16,6.35 0 top
C4  45.09,6.35 0 top
C5  63.5,46.35 180 top
C6  63.5,31.11 180 top
C8  30.48,22.86 0 top
C9  30.48,17.78 90 top
C10  30.48,31.11 0 top
C11  30.48,33.66 0 top
C12  63.5,20.96 180 top
C13  63.5,26.67 0 top
C14  63.5,15.24 180 top
D1  19.05,52.07 180 top
D3  78.74,27.94 0 top
D4  6.99,43.18 270 bottom
DIS1  14.61,43.18 0 top
DIS2  23.5,43.18 0 top
E1  19.05,19.68 90 top
IC1  54.61,33.66 90 top
IC2  7.62,10.16 180 top
IC3  40.01,10.16 90 top
IC4  43.18,30.48 90 top
IC5  21.59,59.05 0 top
IC6  55.24,10.79 180 top
J1  2.54,24.76 270 top
J2  2.54,31.75 270 top
J3  53.98,56.52 0 top
J4  37.47,56.52 0 top
J5  72.39,54.61 0 top
LED1  31.75,41.91 180 top
LED2  76.2,48.26 180 top
LED3  81.28,48.26 180 top
M1  78.74,12.7 270 top
Q1  87,59.05 0 top
R1  33.66,51.44 90 top
R2  86.36,46.99 270 top
R3  88.9,46.99 270 top
R5  19.05,31.11 0 top
R6  19.05,33.66 0 top
R7  78.74,33.02 0 top
R8  78.74,30.48 0 top
R11  43.18,48.89 0 top
R12  8.26,19.68 270 top
R13  35.56,34.92 90 top
R14  71.12,46.35 270 top
R15  35.56,20.32 90 top
R16  43.18,51.44 0 top
R17  68.58,46.35 270 top
SW1  78.74,41.91 0 top
TB1  3.17,46.35 270 top
TB2  3.17,39.37 270 top
TB3  95.89,10.79 90 top
TB4  95.89,20.32 90 top
TB5  95.89,37.47 90 top
TB6  95.89,27.31 90 top
TB7  95.89,48.26 90 top
Y1  47.62,10.79 180 top
Y2  63.5,38.73 270 top

### Tracks (layer width: path | path; a pad name or v marks a point on that pad's centre or on a via)
0V
  Top 0.305: 79.25,48.21 80.01,48.21 LED3.K | LED2.K 76.2,46.99 78.03,46.99 81.92,43.1 81.92,41.96 SW1.2 | J3.6 66.67,48.28 64.77,46.38 C5.1 | LED1.K 30.48,41.96 29.87,42.57 29.87,50.11 C2.2 30.02,50.11 38.1,50.11 44.5,56.52 J4.4 | C6.1 64.77,31.06 63.48,31.06 62.56,30.15 61.87,30.15 59.59,32.44 59.59,33.73 58.45,34.87 IC1.8 | IC1.22 50.75,32.44 50.75,33.05 47.02,36.78 IC4.9 | C10.2 31.77,31.14 31.77,33.66 C11.2
  Bottom 0.305: 64.77,46.38 C5.1
  pour Bottom: 0,59.05 0,0 99.69,0 99.69,59.05
4V3
  Top 0.152: M1.1 69.88,21.61 69.88,24.21 73.61,27.94 D3.C
5V
  Top 0.305: D3.A 88.09,27.94 95.86,35.71 TB5.1 | C12.+ C14.1 | IC1.20 51.36,37.47 56.39,32.44 58.37,32.44 IC1.7 | R16.2 51.74,54.91 51.74,56.06 53.8,58.11 67.36,58.11 68.28,57.2 72.39,57.2 J5.2 | C2.1 29.87,52.7 33.68,56.52 R1.2 | IC5.3 25.98,56.52 29.72,52.78 C2.1 | C9.+ 29.87,17.12 | 29.87,17.12 29.26,17.73 29.26,22.83 C8.1 | IC4.19 R15.2 | C2.1 29.72,52.63 29.72,51.33 28.88,50.49 28.88,41.73 30.56,40.06 35.51,40.06 R13.2 | 29.87,17.12 29.26,16.51 27.05,16.51 20.73,10.18 19.74,10.18 IC3.18
  Bottom 0.305: IC6.8 56.24,3.18 62.79,9.73 63.32,9.73 64.77,11.18 C14.1 | 77.8,27.94 75.29,27.94 70.03,22.68 66.45,22.68 64.77,21.01 C12.+ | 77.8,27.94 D3.A | R17.1 68.58,53.31 72.39,57.12 J5.2 72.16,56.74 73.69,55.22 73.69,54.08 76.2,51.56 76.2,47.75 77.8,46.15 77.8,27.94 | IC1.20 50.83,37.47 51.97,38.61 51.97,43.03 51.28,43.71 50.52,43.71 48.39,45.85 48.39,48.82 R11.2 48.31,48.89 48.31,51.41 R16.2 48.23,51.56 43.81,55.98 43.81,57.05 43.05,57.81 34.98,57.81 33.68,56.52 R1.2 | IC3.18 19.66,10.11 17.68,10.11 15.24,7.67 IC2.3 15.16,7.75 12.8,10.11 7.62,10.11 IC2.5 | R13.2 35.59,39.98 35.59,32.97 39.32,29.24 IC4.19 | C8.1 29.26,22.91 30.48,22.91 32.92,25.35 35.51,25.35 R15.2
11V3
  Top 0.305: D1.C 24.08,52.09 23.7,52.09 19.28,56.52 IC5.1 17.14,54.61 C1.+
12V
  Top 0.305: D1.A 13.95,52.02 7.09,52.02 3.2,48.13 TB1.1
+5V
  Bottom 0.152: 34.94,54.04 37.41,56.52 J4.1 | 34.94,54.04 30.18,49.28 29.49,49.28 29.34,49.43 16.46,49.43 15.7,48.67 15.7,47.52 13.03,44.86 11.89,44.86 10.29,43.26 10.29,15.44 6.93,12.09 2.59,12.09 J1.6 | J3.4 61.19,56.52 59.51,58.19 34.14,58.19 32.77,56.82 32.77,56.21 34.94,54.04
/RESET
  Top 0.152: IC1.1 58.45,17.2 59.51,18.26 59.51,19.71 64.77,24.97 C13.2 64.77,26.72 68.58,30.53 R17.2 68.58,44.09 77.42,52.93 77.42,54.61 J5.5
A
  Top 0.152: DIS2.10 25.15,47.37 20.04,47.37 19.2,48.21 17.14,48.21 DIS1.10
  Bottom 0.152: IC4.14 39.32,41.96 35.74,41.96 30.56,47.14 27.13,47.14 26.06,48.21 DIS2.10
B
  Top 0.152: DIS2.9 25.15,46.61 20.04,46.61 19.2,45.77 17.14,45.77 DIS1.9
  Bottom 0.152: IC4.16 39.32,36.86 39.32,37.47 31.09,45.69 26.06,45.69 DIS2.9
C
  Bottom 0.152: IC4.20 39.32,26.72 39.32,27.41 27.51,39.22 27.51,41.73 26.06,43.18 DIS2.8 25.98,43.18 25.15,44.02 19.96,44.02 19.13,43.18 DIS1.8
CANH
  Top 0.152: IC2.7 7.62,5.46 3.73,9.35 3.73,10.03 2.9,10.87 2.06,10.87 1.37,11.56 1.37,30.61 2.52,31.75 J2.1 2.44,31.75 1.98,32.21 1.98,38.08 3.12,39.22 3.12,41.05 TB2.1
  Bottom 0.152: D4.2 8,42.27 4.34,42.27 3.2,41.12 TB2.1
CANL
  Top 0.152: R12.2 8.31,14.61 8.31,10.87 8.61,10.57 8.61,8.66 7.62,7.67 IC2.6
  Bottom 0.152: TB1.2 3.2,44.55 3.66,44.09 8,44.09 D4.1 8,43.71 9.14,42.57 9.14,15.44 8.31,14.61 R12.2
CLK
  Top 0.152: IC4.13 39.4,44.4 44.27,44.4 45.64,43.03 45.64,42.42 45.49,42.27 45.49,41.58 46.86,40.21 48.01,40.21 49.76,38.46 49.76,37.01 50.75,36.02 52.2,36.02 58.37,29.85 IC1.6
D
  Top 0.152: IC4.23 39.32,19.1 37.19,19.1 26.67,29.62 20.57,29.62 12.12,38.08 DIS1.5
  Bottom 0.152: DIS1.5 12.95,38.99 18.06,38.99 18.9,38.15 20.95,38.15 DIS2.5
DAC_L
  Top 0.152: M1.5 69.88,11.48 81.15,11.48 87.71,18.03 95.33,18.03 95.86,18.57 TB4.1
DAC_R
  Top 0.152: M1.4 69.88,14 78.64,14 93.65,29.01 95.86,29.01 TB6.2
DIG0
  Top 0.152: DIS1.1 12.04,48.21 12.04,47.52 10.59,46.08 10.59,40.28 11.89,38.99 16.31,38.99 17.14,38.15 DIS1.6 17.14,36.4 23.62,29.92 26.82,29.92 36.04,20.7 39.55,20.7 41.15,19.1 46.94,19.1 IC4.2
DIG1
  Bottom 0.152: DIS2.1 20.95,47.68 20.92,47.64 | 20.92,47.64 17.3,44.02 16.15,44.02 15.7,43.56 15.7,42.8 16.99,41.5 18.29,41.5 20.8,38.99 25.15,38.99 DIS2.6 | 20.92,47.64 21.72,46.84 30.4,46.84 36.2,41.05 40.31,41.05 41.15,41.89 46.94,41.89 IC4.11
DIN  (via drill 0.3)
  Top 0.152: v49.3,29.08 49.15,28.93 49.15,27.03 47.93,25.81 47.93,25.04 48.46,24.51 48.46,18.72 47.02,17.27 47.02,16.51 IC4.1
  Bottom 0.152: v49.3,29.08 49.3,32.36 50.83,33.88 51.28,33.88 57.38,39.98 57.38,41.5 IC1.11
DP
  Top 0.152: DIS2.7 23.28,37.88 | 23.28,37.88 23.24,37.85 23.24,30.76 23.77,30.23 26.98,30.23 35.59,21.61 39.32,21.61 IC4.22 | 23.28,37.88 22.17,38.99 20.8,38.99 19.2,40.59 17.14,40.59 DIS1.7
DTR
  Bottom 0.152: C13.1 59.51,29.39 59.51,42.95 58.45,44.02 57.99,44.02 54.03,47.98 54.03,56.52 J3.1
E
  Top 0.152: DIS1.4 12.12,40.67 15.32,40.67 16.15,41.5 20.12,41.5 20.95,40.67 DIS2.4
  Bottom 0.152: IC4.21 39.32,24.13 39.32,24.89 27.51,36.7 27.51,38.46 26.21,39.75 21.79,39.75 20.95,40.59 DIS2.4
ENC0
  Top 0.152: R5.2 24.16,31.14 29.18,31.14 C10.1 31.32,29.01 37.03,29.01 38.1,30.07 49.07,30.07 50.37,28.78 51.28,28.78 52.73,27.33 58.37,27.33 IC1.5
ENC1
  Top 0.152: R6.2 C11.1 29.26,33.66 30.1,34.49 32.16,34.49 33.22,33.43 40.31,33.43 40.84,33.96 40.84,39.75 40.39,40.21 39.24,40.21 37.87,41.58 37.87,46.38 41.6,50.11 50.75,50.11 IC1.15
F
  Top 0.152: DIS1.2 12.12,45.69 15.32,45.69 16.15,44.86 20.12,44.86 20.95,45.69 DIS2.2 20.95,45.62 24.23,42.34 26.59,42.34 29.79,39.14 35.89,39.14 36.12,39.37 IC4.15
G
  Top 0.152: DIS1.3 15.32,43.18 16.15,44.02 20.12,44.02 DIS2.3 22.1,42.04 26.44,42.04 34.14,34.34 39.32,34.34 IC4.17
INT0  (via drill 0.3)
  Top 0.152: v39.93,14.15 37.87,16.21 37.87,17.96 32.08,23.75 7.54,23.75 6.55,24.74 2.59,24.74 J1.1
  Bottom 0.152: 39.97,14.11 40.92,15.06 50.22,15.06 57.38,22.22 57.38,23.75 58.37,24.74 IC1.4 | 39.97,14.11 36.04,10.18 34.98,10.18 IC3.12 | v39.93,14.15 39.97,14.11
ISET
  Top 0.152: R13.1 37.41,29.85 39.32,31.75 IC4.18
LED_FLIM
  Top 0.152: IC1.24 49.76,26.26 49.76,21.77 50.37,21.16 52.88,21.16 57.99,16.05 58.83,16.05 63.25,20.47 63.25,20.93 71.32,29.01 74.68,29.01 87.55,41.89 88.85,41.89 R3.2
LED_SLIM  (via drill 0.3)
  Top 0.152: R2.2 73.76,29.31 v68.12,29.31
  Bottom 0.152: v68.12,29.31 66.06,29.31 62.56,25.81 61.42,25.81 58.45,28.78 51.89,28.78 50.83,29.85 IC1.23
LOAD
  Top 0.152: IC1.14 54.79,46.53 50.75,46.53 48.69,44.47 47.02,44.47 IC4.12
MISO  (via drill 0.3)
  Top 0.152: v58.22,48.89 51.89,42.57 50.83,42.57 IC1.18 | v30.25,13.08 27.36,10.18 IC3.15 | v37.8,22.3 37.8,26.95 38.94,28.09 v40.08,28.09
  Bottom 0.152: J1.4 1.37,15.98 1.37,8.97 3.73,6.6 22.63,6.6 26.14,10.11 27.28,10.11 IC3.15 | v58.22,48.89 67.28,48.89 72.39,54 J5.1 | v30.25,13.08 30.25,14.76 v37.8,22.3 | v40.08,28.09 44.12,32.13 44.12,35.79 46.86,38.53 48.01,38.53 49,39.52 49,40.74 IC1.18
MOSI  (via drill 0.3)
  Top 0.152: J1.3 2.59,19.63 7.16,19.63 17.98,8.81 27.36,8.81 28.65,10.11 29.79,10.11 IC3.14 30.86,11.18 43.51,11.18 48.77,16.43 48.77,24.66 48.46,24.97 v48.46,25.27 | v49.53,39.52 49.53,42.8 50.75,44.02 50.75,45.08 IC1.17
  Bottom 0.152: IC1.17 50.83,45.08 50.83,46.15 52.81,48.13 52.81,57.05 53.49,57.73 59.51,57.73 60.43,56.82 60.43,55.98 61.11,55.3 68.81,55.3 71.86,58.34 73.76,58.34 74.91,57.2 J5.4 | v49.53,39.52 49.53,39.22 48.46,38.15 v48.46,25.27
MP3_RX
  Top 0.152: R7.2 83.82,32.97 69.88,19.03 M1.2
MP3_TX
  Top 0.152: R8.2 83.82,30.46 69.88,16.51 M1.3
N$3
  Top 0.152: LED1.A 33.6,42.49 33.6,46.3 R1.1
N$5
  Top 0.152: J2.2 6.93,24.82 8.23,24.82 R12.1
N$6
  Top 0.152: R5.1 14.02,31.06 14.02,29.62 16.46,27.18 E1.B
N$7
  Top 0.152: R6.1 15.09,33.66 21.57,27.18 E1.A
N$10
  Top 0.152: LED2.A 81.23,52.02 86.33,52.02 R2.1
N$11
  Top 0.152: R3.1 88.85,52.02 87.55,52.02 83.82,48.28 82.6,48.28 LED3.A
N$15
  Top 0.152: Q1.G 81.46,56.52 71.17,46.23 71.17,41.28 R14.2
OSC1
  Top 0.152: Y1.1 50.14,10.79 48.92,9.58 48.92,6.38 C3.1 48.01,5.46 41.53,5.46 38.63,2.57 37.49,2.57 IC3.8
OSC2
  Top 0.152: Y1.2 45.03,10.79 43.81,9.58 C4.1 43.81,6.3 39.78,6.3 36.04,2.57 34.98,2.57 IC3.7
RXCAN
  Top 0.152: IC3.2 22.17,2.57 22.17,3.18 15.24,10.11 IC2.4
RXD
  Top 0.152: J3.3 61.11,54.46 61.11,48.82 65.91,44.02 65.91,30.61 63.93,28.63 63.93,26.26 58.45,20.78 58.45,19.71 IC1.2
SCK  (via drill 0.3)
  Top 0.152: J1.2 20.42,22.22 25.53,17.12 v28.96,17.12 | J5.3 74.07,54.61 72.69,55.98 68.89,55.98 67.13,57.73 58.6,57.73 57.84,56.97 57.84,53.62 60.81,50.65 60.81,44.32 60.12,43.64 54.41,43.64 50.83,40.06 IC1.19
  Bottom 0.152: 32.38,10.18 33.53,10.18 39.01,15.67 44.35,15.67 46.86,18.19 50.83,18.19 51.89,19.25 51.89,25.2 50.83,26.26 50.37,26.26 48.77,27.86 48.77,38 50.75,39.98 IC1.19 | v28.96,17.12 28.96,13.61 32.38,10.18 | 32.38,10.18 IC3.13
SCL  (via drill 0.3)
  Top 0.152: R16.1 38.1,54.61 J4.2 40.84,56.52 42.06,57.73 45.57,57.73 47.4,55.91 47.4,51.1 47.93,50.57 49.68,50.57 50.37,51.26 58.83,51.26 59.74,50.34 v59.74,47.6 | IC6.6 55.24,9.35 50.83,13.77 50.83,17.12 IC1.28 | v45.72,15.6 43.74,13.61 29.34,13.61 26.29,10.57 26.29,10.26 25.15,9.12 19.28,9.12 16.54,11.86 16.54,12.7 E1.SW+
  Bottom 0.152: v45.72,15.6 49.23,15.6 50.75,17.12 IC1.28 50.83,17.2 52.2,18.57 52.2,20.01 57.99,25.81 58.9,25.81 59.21,25.5 65.08,25.5 68.58,29.01 73.38,29.01 75.44,31.06 75.44,41.89 SW1.1 75.36,41.89 75.13,42.11 65.23,42.11 v59.74,47.6
SDA  (via drill 0.3)
  Top 0.152: IC6.5 55.24,15.21 50.83,19.63 IC1.27 | v45.11,30.61 v45.11,42.8
  Bottom 0.152: J4.3 42.52,56.52 42.52,54.61 38.1,50.19 R11.1 39.01,48.89 v45.11,42.8 | v45.11,30.61 45.11,26.72 46.86,24.97 48.01,24.97 49.76,23.22 49.76,20.7 50.75,19.71 IC1.27
SPK_1
  Top 0.152: M1.6 83.67,8.89 87.25,12.47 95.86,12.47 TB3.2
SPK_2
  Top 0.152: 70.87,3.86 83.74,3.86 87.78,7.9 94.72,7.9 95.86,9.04 TB3.1 | 70.87,3.86 69.88,3.86 M1.8 | 70.87,3.86 70.87,6.76 70.26,7.37 69.95,7.37 65.53,11.79 61.8,11.79 52.81,20.78 50.29,20.78 49.45,21.61 49.45,27.48 50.37,28.4 51.21,28.4 51.89,27.71 51.89,26.87 50.83,25.81 50.83,24.82 IC1.25
SS  (via drill 0.3)
  Top 0.152: v39.7,47.45 39.85,47.6 50.75,47.6 IC1.16
  Bottom 0.152: 14.33,11.18 4.19,11.18 J1.7 | 14.33,11.18 22.63,11.18 23.62,10.18 24.77,10.18 IC3.16 | v39.7,47.45 28.65,47.45 26.98,49.12 19.81,49.12 17.3,46.61 16.23,46.61 13.56,43.94 13.56,40.28 12.27,38.99 11.12,38.99 10.59,38.46 10.59,24.21 14.33,20.47 14.33,11.18
SS_RX
  Bottom 0.152: IC1.12 60.5,45.08 60.81,44.78 60.81,42.42 72.69,30.53 73.61,30.53 R8.1
SS_TX
  Bottom 0.152: R7.1 73.61,33.05 73.23,33.05 58.67,47.6 58.45,47.6 IC1.13
STL_2
  Top 0.152: Q1.D 87.02,56.52 87.02,55.37 95.86,46.53 TB7.1
STL_DRV  (via drill 0.3)
  Top 0.152: v63.93,44.17 63.93,42.34 65.61,40.67 65.61,30.76 63.55,28.7 61.27,28.7 59.51,26.95 59.51,26.87 58.45,25.81 54.41,25.81 50.83,22.22 IC1.26
  Bottom 0.152: v63.93,44.17 63.93,46.76 64.39,47.22 66.06,47.22 70.26,51.41 71.09,51.41 R14.1
TXCAN
  Top 0.152: IC3.1 19.66,2.57 15.24,2.57 IC2.1
TXD  (via drill 0.3)
  Top 0.152: v61.49,28.17 61.34,28.02 61.34,26.19 58.45,23.29 58.45,22.22 IC1.3 | v60.27,44.55 60.27,50.72 56.54,54.46 56.54,56.52 J3.2
  Bottom 0.152: v61.49,28.17 61.49,30.61 60.27,31.83 v60.27,44.55
XTAL1
  Top 0.152: Y2.2 62.29,34.99 | 62.29,34.99 62.26,34.95 62.26,31.14 C6.2 | IC1.9 59.82,37.47 62.29,34.99
XTAL2
  Top 0.152: 62.29,42.46 63.48,41.28 Y2.1 | 62.29,42.46 62.26,42.49 62.26,46.3 C5.2 | 62.29,42.46 59.89,40.06 58.45,40.06 IC1.10
~RESET
  Top 0.152: IC3.17 27.28,15.21 35.51,15.21 R15.1

### Text on the board
tNames: 5V | SCL | SDA | 0V | DTR | RXD | TXD | 5V | CTS | 0V | STL+ | Grn | Ylw | 12V | CANL | +5V | STL- | CANH | 0V | 0V | 0V | 5V | CAN Bus / term 120R | DAC / R | 0V | INT | SCK | 0V | SI | DAC / L | SO | 0V | 5V | SPK / 1 | SS | SPK / 2
bNames: CBUS MP3 Player Rev. F | © Duncan Greenwood January 2018